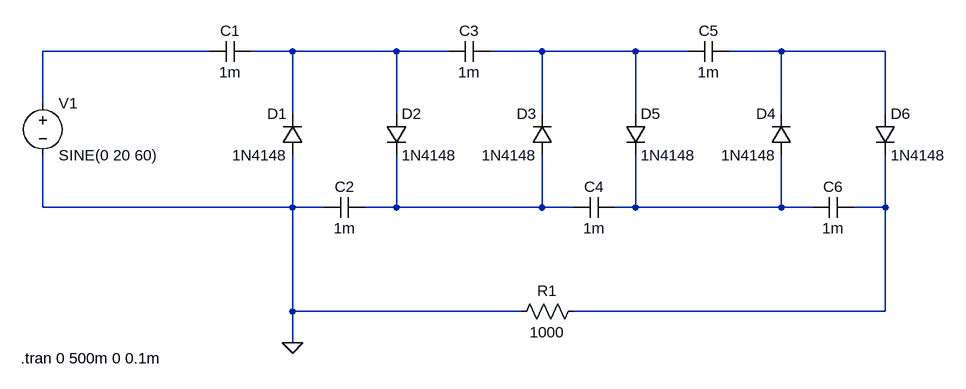
[diagram p0: schematic multiplicador de tensão.asc]
multiplicador de tensão.asc, the LTspice schematic file:
Version 4
SHEET 1 1048 680
WIRE -176 -64 -432 -64
WIRE -48 -64 -112 -64
WIRE 112 -64 -48 -64
WIRE 192 -64 112 -64
WIRE 336 -64 256 -64
WIRE 480 -64 336 -64
WIRE 560 -64 480 -64
WIRE 704 -64 624 -64
WIRE 864 -64 704 -64
WIRE -432 16 -432 -64
WIRE -48 32 -48 -64
WIRE 112 32 112 -64
WIRE 336 32 336 -64
WIRE 480 32 480 -64
WIRE 704 32 704 -64
WIRE 864 32 864 -64
WIRE -432 176 -432 96
WIRE -48 176 -48 96
WIRE -48 176 -432 176
WIRE 0 176 -48 176
WIRE 112 176 112 96
WIRE 112 176 64 176
WIRE 336 176 336 96
WIRE 336 176 112 176
WIRE 384 176 336 176
WIRE 480 176 480 96
WIRE 480 176 448 176
WIRE 704 176 704 96
WIRE 704 176 480 176
WIRE 752 176 704 176
WIRE 864 176 864 96
WIRE 864 176 816 176
WIRE -48 336 -48 176
WIRE 304 336 -48 336
WIRE 864 336 864 176
WIRE 864 336 384 336
WIRE -48 384 -48 336
FLAG -48 384 0
SYMBOL cap -112 -80 R90
WINDOW 0 0 32 VBottom 2
WINDOW 3 32 32 VTop 2
SYMATTR InstName C1
SYMATTR Value 1m
SYMBOL cap 64 160 R90
WINDOW 0 0 32 VBottom 2
WINDOW 3 32 32 VTop 2
SYMATTR InstName C2
SYMATTR Value 1m
SYMBOL cap 256 -80 R90
WINDOW 0 0 32 VBottom 2
WINDOW 3 32 32 VTop 2
SYMATTR InstName C3
SYMATTR Value 1m
SYMBOL cap 448 160 R90
WINDOW 0 0 32 VBottom 2
WINDOW 3 32 32 VTop 2
SYMATTR InstName C4
SYMATTR Value 1m
SYMBOL cap 624 -80 R90
WINDOW 0 0 32 VBottom 2
WINDOW 3 32 32 VTop 2
SYMATTR InstName C5
SYMATTR Value 1m
SYMBOL cap 816 160 R90
WINDOW 0 0 32 VBottom 2
WINDOW 3 32 32 VTop 2
SYMATTR InstName C6
SYMATTR Value 1m
SYMBOL diode -32 96 R180
WINDOW 0 24 64 Left 2
WINDOW 3 24 0 Left 2
SYMATTR InstName D1
SYMATTR Value 1N4148
SYMBOL diode 96 32 R0
SYMATTR InstName D2
SYMATTR Value 1N4148
SYMBOL voltage -432 0 R0
WINDOW 123 0 0 Left 0
WINDOW 39 0 0 Left 0
SYMATTR InstName V1
SYMATTR Value SINE(0 20 60)
SYMBOL diode 352 96 R180
WINDOW 0 24 64 Left 2
WINDOW 3 24 0 Left 2
SYMATTR InstName D3
SYMATTR Value 1N4148
SYMBOL diode 720 96 R180
WINDOW 0 24 64 Left 2
WINDOW 3 24 0 Left 2
SYMATTR InstName D4
SYMATTR Value 1N4148
SYMBOL diode 464 32 R0
SYMATTR InstName D5
SYMATTR Value 1N4148
SYMBOL diode 848 32 R0
SYMATTR InstName D6
SYMATTR Value 1N4148
SYMBOL res 400 320 R90
WINDOW 0 0 56 VBottom 2
WINDOW 3 32 56 VTop 2
SYMATTR InstName R1
SYMATTR Value 1000
TEXT -466 408 Left 2 !.tran 0 500m 0 0.1m

The netlist it stands for:
* multiplicador de tensão.asc
C1 N002 N001 1m
C2 N005 0 1m
C3 N003 N002 1m
C4 N006 N005 1m
C5 N004 N003 1m
C6 N007 N006 1m
D1 0 N002 1N4148
D2 N002 N005 1N4148
V1 N001 0 SINE(0 20 60)
D3 N005 N003 1N4148
D4 N006 N004 1N4148
D5 N003 N006 1N4148
D6 N004 N007 1N4148
R1 N007 0 1000
.model D D
.lib standard.dio
.tran 0 500m 0 0.1m
.backanno
.end